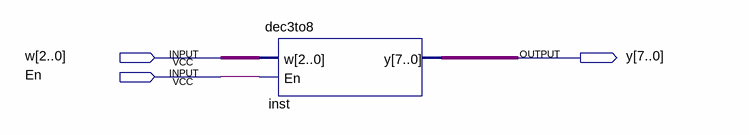
[diagram p0: schematic sheet]
// Quartus schematic TESTdec3to8.bdf as structural Verilog: 1 symbols, 3 pins
module TESTdec3to8 (
  input  [2:0] w,
  input  En,
  output [7:0] y
);

  dec3to8 inst (.w(w), .En(En), .y(y));
endmodule
